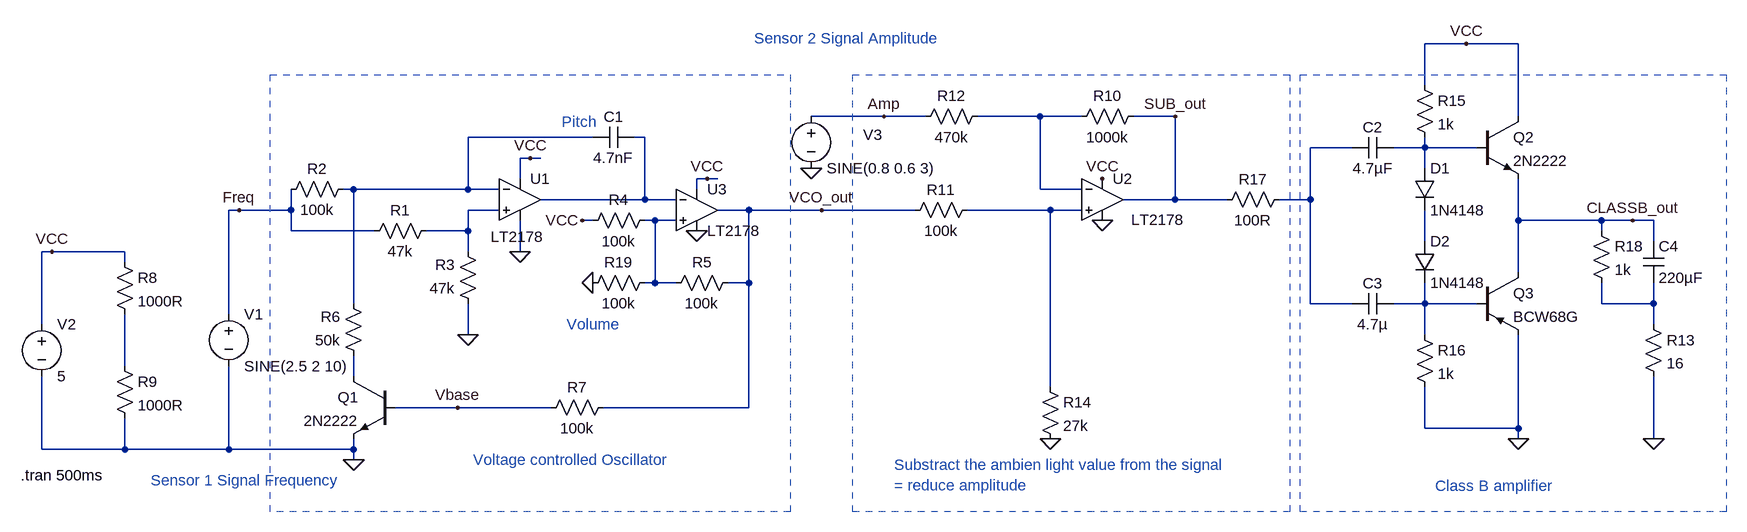
[diagram p0: schematic LTspice-Theremint.asc]
LTspice-Theremint.asc, the LTspice schematic file:
Version 4
SHEET 1 2068 900
WIRE 1664 -32 1600 -32
WIRE 1744 -32 1664 -32
WIRE 1600 32 1600 -32
WIRE 768 80 656 80
WIRE 832 80 768 80
WIRE 1008 80 912 80
WIRE 1072 80 1008 80
WIRE 1216 80 1152 80
WIRE 1744 80 1744 -32
WIRE 320 112 128 112
WIRE 400 112 384 112
WIRE 1488 128 1424 128
WIRE 1600 128 1600 112
WIRE 1600 128 1552 128
WIRE 1680 128 1600 128
WIRE 224 144 208 144
WIRE 240 144 224 144
WIRE 1600 160 1600 128
WIRE 208 176 208 144
WIRE 496 176 480 176
WIRE 512 176 496 176
WIRE -48 192 -64 192
WIRE 128 192 128 112
WIRE 128 192 -48 192
WIRE 176 192 128 192
WIRE 480 192 480 176
WIRE 1008 192 1008 80
WIRE 1072 192 1008 192
WIRE 400 208 400 112
WIRE 400 208 240 208
WIRE 448 208 400 208
WIRE 1216 208 1216 80
WIRE 1216 208 1136 208
WIRE 1296 208 1216 208
WIRE 1424 208 1424 128
WIRE 1424 208 1376 208
WIRE -224 224 -240 224
WIRE -144 224 -144 192
WIRE -144 224 -224 224
WIRE 176 224 128 224
WIRE 560 224 512 224
WIRE 672 224 560 224
WIRE 816 224 672 224
WIRE 1024 224 896 224
WIRE 1072 224 1024 224
WIRE 320 240 304 240
WIRE 416 240 400 240
WIRE 448 240 416 240
WIRE 1744 240 1744 176
WIRE 1872 240 1744 240
WIRE 1920 240 1872 240
WIRE 1952 240 1920 240
WIRE -144 256 -144 224
WIRE -16 256 -144 256
WIRE 128 256 128 224
WIRE 128 256 64 256
WIRE 1872 256 1872 240
WIRE 1600 272 1600 224
WIRE 1952 272 1952 240
WIRE -512 288 -528 288
WIRE -400 288 -512 288
WIRE 128 288 128 256
WIRE 208 288 208 240
WIRE -400 304 -400 288
WIRE 1744 320 1744 240
WIRE 416 336 416 240
WIRE 416 336 400 336
WIRE 448 336 416 336
WIRE 560 336 560 224
WIRE 560 336 528 336
WIRE -48 368 -48 192
WIRE 1424 368 1424 208
WIRE 1488 368 1424 368
WIRE 1600 368 1600 336
WIRE 1600 368 1552 368
WIRE 1680 368 1600 368
WIRE 1872 368 1872 336
WIRE 1952 368 1952 336
WIRE 1952 368 1872 368
WIRE -240 384 -240 224
WIRE -528 400 -528 288
WIRE 1952 400 1952 368
WIRE 128 416 128 368
WIRE 1600 416 1600 368
WIRE -400 464 -400 384
WIRE -48 480 -48 448
WIRE 1024 496 1024 224
WIRE 112 528 16 528
WIRE 256 528 112 528
WIRE 560 528 560 336
WIRE 560 528 336 528
WIRE 1600 560 1600 496
WIRE 1744 560 1744 416
WIRE 1744 560 1600 560
WIRE 1744 576 1744 560
WIRE 1952 576 1952 480
WIRE -528 592 -528 480
WIRE -400 592 -400 544
WIRE -400 592 -528 592
WIRE -240 592 -240 464
WIRE -240 592 -400 592
WIRE -48 592 -48 576
WIRE -48 592 -240 592
WIRE -48 608 -48 592
FLAG 208 288 0
FLAG 128 416 0
FLAG 224 144 VCC
FLAG 496 176 VCC
FLAG -48 608 0
FLAG 480 256 0
FLAG -512 288 VCC
FLAG 656 160 0
FLAG 1104 176 VCC
FLAG 1104 240 0
FLAG 1024 576 0
FLAG 1744 576 0
FLAG 1664 -32 VCC
FLAG 1952 576 0
FLAG -224 224 Freq
FLAG 768 80 Amp
FLAG 304 240 VCC
FLAG 320 336 0
FLAG 672 224 VCO_out
FLAG 1216 80 SUB_out
FLAG 1920 240 CLASSB_out
FLAG 112 528 Vbase
SYMBOL Opamps\\LT2178 208 144 R0
WINDOW 3 -45 121 Left 2
SYMATTR InstName U1
SYMBOL Opamps\\LT2178 480 160 R0
SYMATTR InstName U3
SYMBOL cap 384 96 R90
WINDOW 0 0 32 VBottom 2
WINDOW 3 32 32 VTop 2
SYMATTR InstName C1
SYMATTR Value 4.7nF
SYMBOL res 80 240 R90
WINDOW 0 0 56 VBottom 2
WINDOW 3 32 56 VTop 2
SYMATTR InstName R1
SYMATTR Value 47k
SYMBOL res -48 176 R90
WINDOW 0 0 56 VBottom 2
WINDOW 3 32 56 VTop 2
SYMATTR InstName R2
SYMATTR Value 100k
SYMBOL res 144 384 R180
WINDOW 0 36 76 Left 2
WINDOW 3 36 40 Left 2
SYMATTR InstName R3
SYMATTR Value 47k
SYMBOL res 416 224 R90
WINDOW 0 0 56 VBottom 2
WINDOW 3 32 56 VTop 2
SYMATTR InstName R4
SYMATTR Value 100k
SYMBOL res 432 352 R270
WINDOW 0 32 56 VTop 2
WINDOW 3 0 56 VBottom 2
SYMATTR InstName R5
SYMATTR Value 100k
SYMBOL npn 16 480 M0
SYMATTR InstName Q1
SYMATTR Value 2N2222
SYMBOL res -32 464 R180
WINDOW 0 36 76 Left 2
WINDOW 3 36 40 Left 2
SYMATTR InstName R6
SYMATTR Value 50k
SYMBOL res 352 512 R90
WINDOW 0 0 56 VBottom 2
WINDOW 3 32 56 VTop 2
SYMATTR InstName R7
SYMATTR Value 100k
SYMBOL voltage -240 368 R0
WINDOW 123 0 0 Left 0
WINDOW 39 0 0 Left 0
SYMATTR InstName V1
SYMATTR Value SINE(2.5 2 10)
SYMBOL voltage -528 384 R0
WINDOW 123 0 0 Left 0
WINDOW 39 0 0 Left 0
SYMATTR InstName V2
SYMATTR Value 5
SYMBOL res -416 288 R0
SYMATTR InstName R8
SYMATTR Value 1000R
SYMBOL res -416 448 R0
SYMATTR InstName R9
SYMATTR Value 1000R
SYMBOL voltage 656 64 R0
WINDOW 123 0 0 Left 0
WINDOW 39 0 0 Left 0
WINDOW 0 80 44 Left 2
SYMATTR InstName V3
SYMATTR Value SINE(0.8 0.6 3)
SYMBOL Opamps\\LT2178 1104 144 R0
WINDOW 3 44 95 Left 2
SYMATTR InstName U2
SYMBOL res 800 240 R270
WINDOW 0 32 56 VTop 2
WINDOW 3 0 56 VBottom 2
SYMATTR InstName R11
SYMATTR Value 100k
SYMBOL res 1056 96 R270
WINDOW 0 32 56 VTop 2
WINDOW 3 0 56 VBottom 2
SYMATTR InstName R10
SYMATTR Value 1000k
SYMBOL res 1008 480 R0
SYMATTR InstName R14
SYMATTR Value 27k
SYMBOL res 816 96 R270
WINDOW 0 32 56 VTop 2
WINDOW 3 0 56 VBottom 2
SYMATTR InstName R12
SYMATTR Value 470k
SYMBOL npn 1680 80 R0
SYMATTR InstName Q2
SYMATTR Value 2N2222
SYMBOL pnp 1680 320 R0
SYMATTR InstName Q3
SYMATTR Value BCW68G
SYMBOL diode 1584 160 R0
SYMATTR InstName D1
SYMATTR Value 1N4148
SYMBOL diode 1584 272 R0
SYMATTR InstName D2
SYMATTR Value 1N4148
SYMBOL res 1936 384 R0
SYMATTR InstName R13
SYMATTR Value 16
SYMBOL cap 1552 112 R90
WINDOW 0 0 32 VBottom 2
WINDOW 3 32 32 VTop 2
SYMATTR InstName C2
SYMATTR Value 4.7µF
SYMBOL cap 1552 352 R90
WINDOW 0 0 32 VBottom 2
WINDOW 3 32 32 VTop 2
SYMATTR InstName C3
SYMATTR Value 4.7µ
SYMBOL res 1584 16 R0
SYMATTR InstName R15
SYMATTR Value 1k
SYMBOL res 1584 400 R0
SYMATTR InstName R16
SYMATTR Value 1k
SYMBOL res 1392 192 R90
WINDOW 0 0 56 VBottom 2
WINDOW 3 32 56 VTop 2
SYMATTR InstName R17
SYMATTR Value 100R
SYMBOL cap 1936 272 R0
SYMATTR InstName C4
SYMATTR Value 220µF
SYMBOL res 1856 240 R0
SYMATTR InstName R18
SYMATTR Value 1k
SYMBOL res 416 320 R90
WINDOW 0 0 56 VBottom 2
WINDOW 3 32 56 VTop 2
SYMATTR InstName R19
SYMATTR Value 100k
TEXT 280 400 Left 2 ;Volume
TEXT 272 88 Left 2 ;Pitch
TEXT -560 632 Left 2 !.tran 500ms
TEXT 136 608 Left 2 ;Voltage controlled Oscillator
TEXT 784 616 Left 2 ;Substract the ambien light value from the signal \n= reduce amplitude
TEXT -360 640 Left 2 ;Sensor 1 Signal Frequency
TEXT 568 -40 Left 2 ;Sensor 2 Signal Amplitude
TEXT 1616 648 Left 2 ;Class B amplifier
RECTANGLE Normal 624 688 -176 16 2
RECTANGLE Normal 1392 688 720 16 2
RECTANGLE Normal 2064 688 1408 16 2

The netlist it stands for:
* LTspice-Theremint.asc
XU1 N006 N002 VCC 0 N003 LT2178  ; pins In+ In- V+ V- OUT
XU3 N008 N003 VCC 0 VCO_out LT2178  ; pins In+ In- V+ V- OUT
C1 N003 N002 4.7nF
R1 N006 Freq 47k
R2 N002 Freq 100k
R3 0 N006 47k
R4 N008 VCC 100k
R5 N008 VCO_out 100k
Q1 N013 Vbase 0 0 2N2222
R6 N013 N002 50k
R7 VCO_out Vbase 100k
V1 Freq 0 SINE(2.5 2 10)
V2 VCC 0 5
R8 VCC N012 1000R
R9 N012 0 1000R
V3 Amp 0 SINE(0.8 0.6 3)
XU2 N007 N001 VCC 0 SUB_out LT2178  ; pins In+ In- V+ V- OUT
R11 VCO_out N007 100k
R10 N001 SUB_out 1000k
R14 N007 0 27k
R12 Amp N001 470k
Q2 VCC N005 CLASSB_out 0 2N2222
Q3 CLASSB_out N010 0 0 BCW68G
D1 N005 N009 1N4148
D2 N009 N010 1N4148
R13 N011 0 16
C2 N005 N004 4.7µF
C3 N010 N004 4.7µ
R15 VCC N005 1k
R16 N010 0 1k
R17 N004 SUB_out 100R
C4 CLASSB_out N011 220µF
R18 CLASSB_out N011 1k
R19 N008 0 100k
.model D D
.lib standard.dio
.model NPN NPN
.model PNP PNP
.lib standard.bjt
* Volume
* Pitch
.tran 500ms
* Voltage controlled Oscillator
* Substract the ambien light value from the signal
* = reduce amplitude
* Sensor 1 Signal Frequency
* Sensor 2 Signal Amplitude
* Class B amplifier
.backanno
.end